# EAGLE design ! Famicom_IO_SNES_REV1.5 (EAGLE 9.1.3)
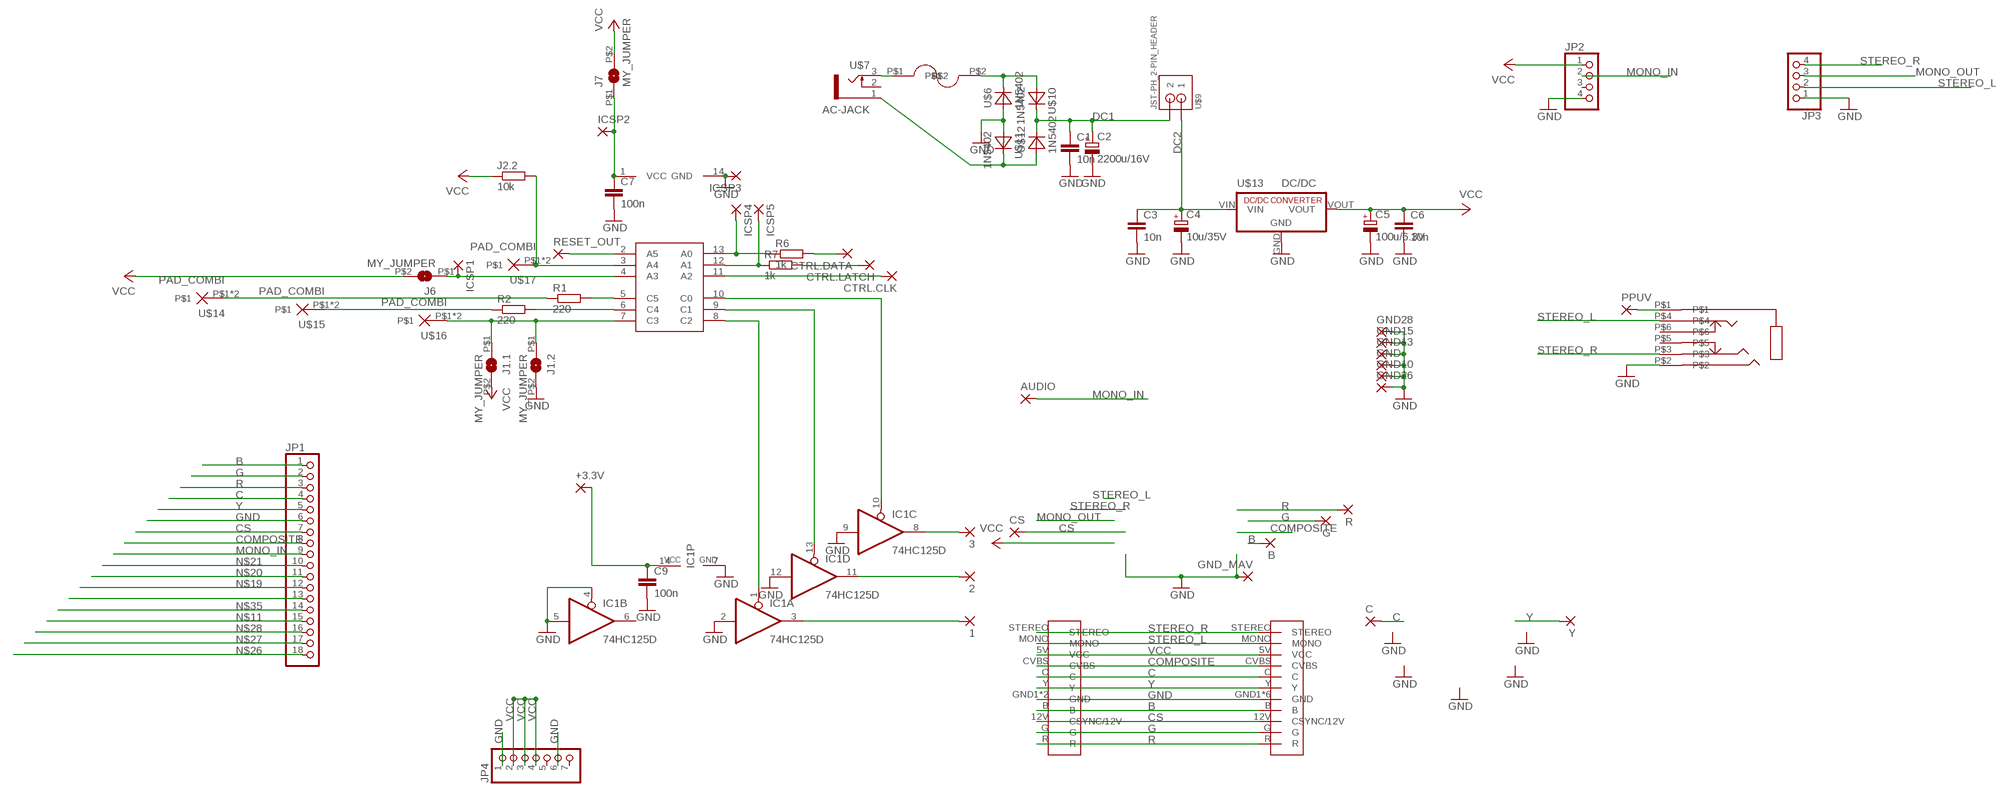
[diagram p0: schematic, sheet 1]

## Parts
1  SMD2  [SMD1,27-2,54]
2  SMD2  [SMD1,27-2,54]
3  SMD2  [SMD1,27-2,54]
+3.3V  SMD2  [SMD1,27-2,54]
AUDIO  SMD2  [SMD1,27-2,54]
B  SMD2  [SMD1,27-2,54]
C  SMD2  [SMD1,27-2,54]
C1  10n  C0805  [Z0805]
C2  2200u/16V  CPOL-EUE5-13  [E5-13]
C3  10n  C0805  [Z0805]
C4  10u/35V  CPOL-EUB  [PANASONIC_B]
C5  100u/6.3V  CPOL-EUD  [PANASONIC_D]
C6  10n  C0805  [Z0805]
C7  100n  C0805  [Z0805]
C9  100n  C0805  [Z0805]
CS  SMD2  [SMD1,27-2,54]
CTRL.CLK  SMD2  [SMD1,27-2,54]
CTRL.DATA  SMD2  [SMD1,27-2,54]
CTRL.LATCH  SMD2  [SMD1,27-2,54]
G  SMD2  [SMD1,27-2,54]
GND  SMD5  [SMD2,54-5,08]
GND10  SMD5  [SMD2,54-5,08]
GND13  SMD5  [SMD2,54-5,08]
GND15  SMD5  [SMD2,54-5,08]
GND26  SMD5  [SMD2,54-5,08]
GND28  SMD5  [SMD2,54-5,08]
GND_MAV  SMD2  [SMD1,27-2,54]
IC1  74HC125D  [SO14]
ICSP1  1,6/0,8  [1,6/0,8]
ICSP2  1,6/0,8  [1,6/0,8]
ICSP3  1,6/0,8  [1,6/0,8]
ICSP4  1,6/0,8  [1,6/0,8]
ICSP5  1,6/0,8  [1,6/0,8]
J1.1  MY_JUMPER  [MYJUMP]
J1.2  MY_JUMPER  [MYJUMP]
J2.2  10k  R0805  [Z0805]
J6  MY_JUMPER  [MYJUMP]
J7  MY_JUMPER  [MYJUMP]
JP1  PINHD-1X18_2.00  [1X18M]
JP2  PINHD-1X04_2.54-S  [1X04-S]
JP3  PINHD-1X04_2.54-S  [1X04-S]
JP4  PINHD-1X07_2.54-S  [1X07-S]
PPUV  SMD2  [SMD1,27-2,54]
R  SMD2  [SMD1,27-2,54]
R1  220  R0805  [Z0805]
R2  220  R0805  [Z0805]
R6  1k  R0805  [Z0805]
R7  1k  R0805  [Z0805]
RESET_OUT  SMD2  [SMD1,27-2,54]
U$2  FUSEHOLDER  [FUSEHOLDER]
U$5  PIC16F630_SIMPLE  [PIC16F630]
U$6  1N5402  [DO201]
U$7  AC-JACK  [AC-JACK]
U$8  PJ-342D  [PJ-342]
U$9  JST-PH_2-PIN_HEADER  [JST_B2B-PH_HEADER]
U$10  1N5402  [DO201]
U$11  1N5402  [DO201]
U$12  1N5402  [DO201]
U$13  DC/DC  [RECOM]
U$14  PAD_COMBI  [PAD_COMBI]
U$15  PAD_COMBI  [PAD_COMBI]
U$16  PAD_COMBI  [PAD_COMBI]
U$17  PAD_COMBI  [PAD_COMBI]
U$19  GC-MULTIAV  [GC-MULTIAV]
U$20  SNES-MULTIAV2  [SNES-MULTIAV2]
Y  SMD2  [SMD1,27-2,54]

## Nets
AC1A: U$2.P$1 U$7.3
AC1B: U$2.P$2 U$6.C U$10.A
AC2: U$7.1 U$11.C U$12.A
B: B.1(P) JP1.1 U$19.B U$20.B
C: C.1(P) JP1.4 U$19.C U$20.C
COMPOSITE: JP1.8 PPUV.1(P) U$8.P$1 U$19.CVBS U$20.CVBS
CS: CS.1(P) JP1.7 U$19.12V(CSYNC/12V) U$20.12V(CSYNC/12V)
DC1: C1.1 C2.+ U$9.P2 U$10.C U$12.C
DC2: C3.1 C4.+ U$9.P1 U$13.VIN
G: G.1(P) JP1.2 U$19.G U$20.G
GND: C1.2 C2.- C3.2 C4.- C5.- C6.2 C7.2 C9.2 GND10.1(P) GND13.1(P) GND15.1(P) GND26.1(P) GND28.1(P) GND.1(P) GND_MAV.1(P) IC1.2(A:I) IC1.4(B:OE) IC1.5(B:I) IC1.7(P:GND) IC1.9(C:I) IC1.12(D:I) ICSP3.1(P) J1.2.P$2 JP1.6 JP2.4 JP3.1 JP4.1 JP4.6 U$5.14(GND) U$6.A U$8.P$2 U$11.A U$13.GND U$19.GND1(GND) U$19.GND2(GND) U$19.GND3(GND) U$19.GND4(GND) U$19.GND5(GND) U$19.GND6(GND) U$20.GND1(GND) U$20.GND2(GND)
MONO_IN: AUDIO.1(P) JP1.9 JP2.2
MONO_OUT: JP3.3
N$11: 3.1(P) IC1.8(C:O) JP1.15
N$12: J2.2.2 U$5.3(A4) U$17.P$1 U$17.P$2
N$13: R1.2 U$5.5(C5)
N$14: R2.2 U$5.6(C4)
N$15: R1.1 U$14.P$1 U$14.P$2
N$16: R2.1 U$15.P$1 U$15.P$2
N$17: J1.1.P$1 J1.2.P$1 U$5.7(C3) U$16.P$1 U$16.P$2
N$19: CTRL.DATA.1(P) JP1.12 R6.2
N$20: CTRL.LATCH.1(P) JP1.11 R7.2
N$21: CTRL.CLK.1(P) JP1.10 U$5.11(A2)
N$23: IC1.10(C:OE) U$5.10(C0)
N$24: IC1.13(D:OE) U$5.9(C1)
N$25: IC1.1(A:OE) U$5.8(C2)
N$26: +3.3V.1(P) C9.1 IC1.14(P:VCC) JP1.18
N$27: 1.1(P) IC1.3(A:O) JP1.17
N$28: 2.1(P) IC1.11(D:O) JP1.16
N$29: JP1.13
N$31: C7.1 ICSP2.1(P) J7.P$1 U$5.1(VCC)
N$32: ICSP1.1(P) J6.P$1 U$5.4(A3)
N$33: ICSP4.1(P) R6.1 U$5.13(A0)
N$34: ICSP5.1(P) R7.1 U$5.12(A1)
N$35: JP1.14 RESET_OUT.1(P) U$5.2(A5)
R: JP1.3 R.1(P) U$19.R U$20.R
STEREO_L: JP3.2 U$8.P$4 U$19.MONO U$20.MONO
STEREO_R: JP3.4 U$8.P$3 U$19.STEREO U$20.STEREO
VCC: C5.+ C6.1 J1.1.P$2 J2.2.1 J6.P$2 J7.P$2 JP2.1 JP4.2 JP4.3 JP4.4 U$13.VOUT U$19.5V(VCC) U$20.5V(VCC)
Y: JP1.5 U$19.Y U$20.Y Y.1(P)
Unconnected: IC1.6(B:O) JP2.3 JP4.5 JP4.7 U$7.2 U$8.P$5 U$8.P$6

## Library data of the parts
1-3 +3.3V AUDIO B C CS CTRL.CLK CTRL.DATA CTRL.LATCH G GND_MAV PPUV R RESET_OUT Y = wirepad:SMD2: SMD PAD
C1 C3 C6 C7 C9 = snes_div:C0805
C2 = resistor:CPOL-EU: POLARIZED CAPACITOR, European symbol
C4 C5 = rcl:CPOL-EU: POLARIZED CAPACITOR, European symbol
GND GND10 GND13 GND15 GND26 GND28 = wirepad:SMD5: SMD PAD
IC1 = 74xx-eu:74*125: Quad bus BUFFER, 3-state
ICSP1-ICSP5 = wirepad:1,6/0,8: THROUGH-HOLE PAD
J1.1 J1.2 J6 J7 = snes_div:MY_JUMPER
J2.2 R1 R2 R6 R7 = snes_div:R0805
JP1 = pinhead-2:PINHD-1X18: PIN HEADER
JP2 JP3 = pinhead-2:PINHD-1X04: PIN HEADER
JP4 = pinhead-2:PINHD-1X07: PIN HEADER
U$2 = nintendo:FUSEHOLDER
U$5 = snes_div:PIC16F630_SIMPLE
U$6 U$10-U$12 = nintendo:1N5402
U$7 = nintendo:AC-JACK
U$8 = TRP_Custom:PJ-342D
U$9 = SRG:JST-PH_2-PIN_HEADER: 2-pin JST PH Shrouded Header, top entry P/N B2B-PH-K-S Mating connector PHR-2 Mating cable assembly: Sparkfun PRT-09914 <http://www.sparkfun.com/products/9914>
U$13 = nintendo:DC/DC
U$14-U$17 = MS_Mod:PAD_COMBI
U$19 = nintendo:GC-MULTIAV
U$20 = nintendo:SNES-MULTIAV2

## Board
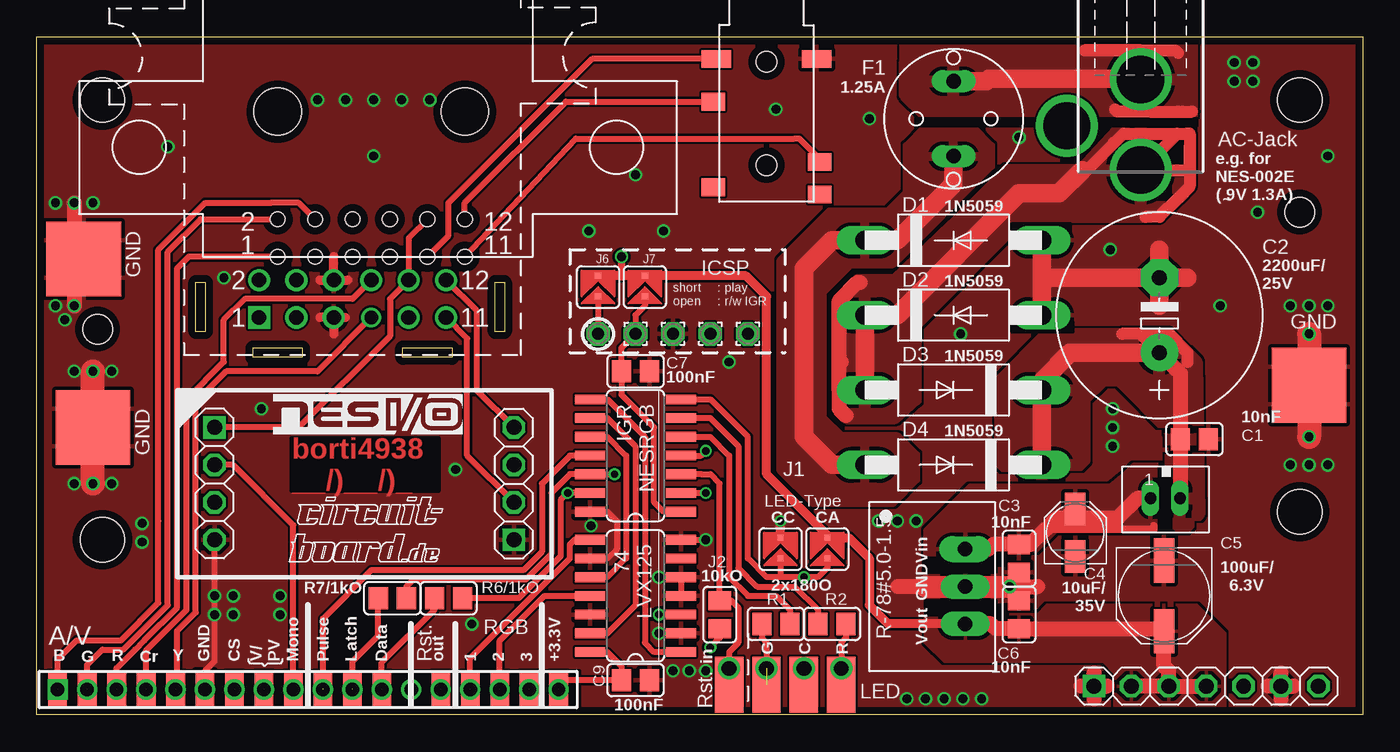
[diagram p1: board, top side]
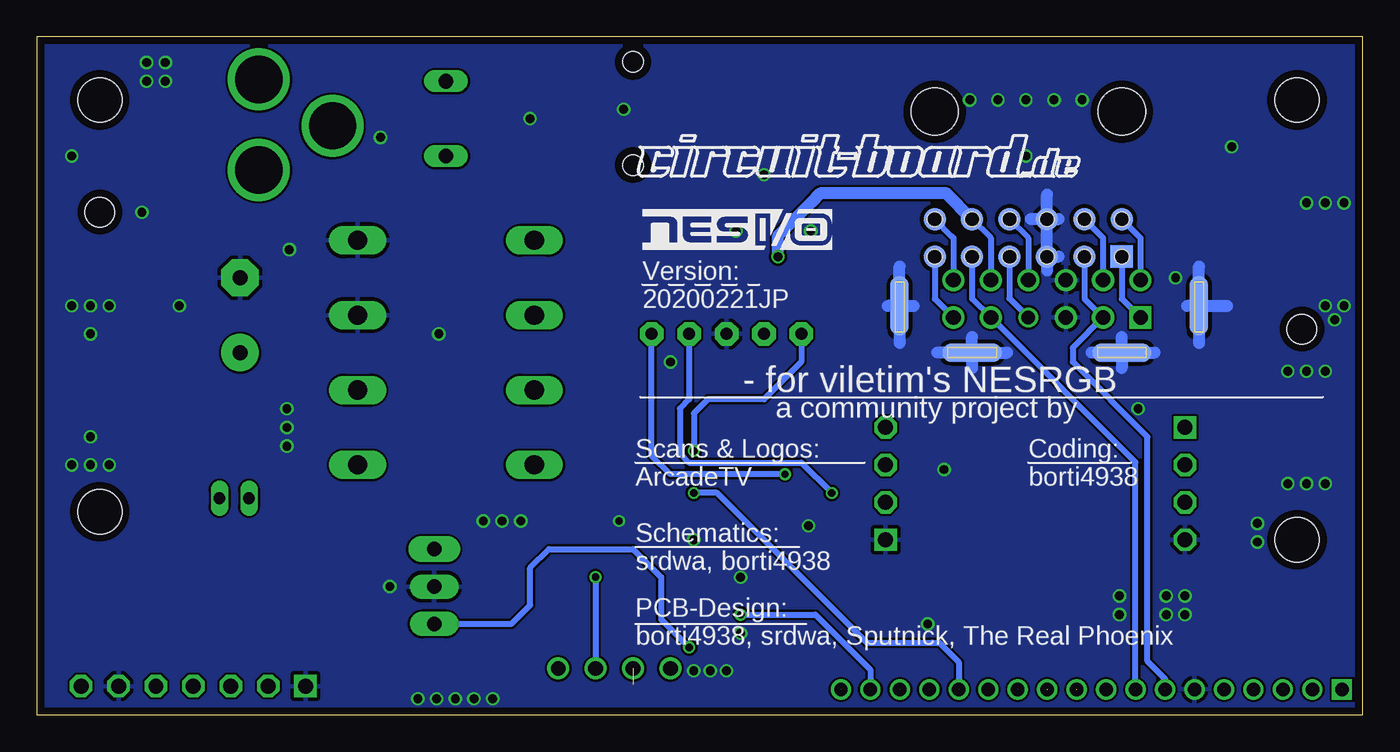
[diagram p2: board, bottom side, seen from below]

Size 90 x 46 mm. Coordinates in mm from the lower left corner, seen from the top.
Outline: 0,46 90,46 90,0 0,0 0,46
Copper layers (1*16): Top 0.035mm / dielectric 1.6mm / Bottom 0.035mm
Design rules "Elecrow_2-layer_PCB_eagle_rule": minimum track width 6mil, minimum drill 12mil, track to track 6mil, track to pad 6mil, pad to pad 6mil, via to via 8mil, smd to smd 0mil, copper to edge 20mil, drill to drill 10mil, minimum pad ring 6mil, minimum via ring 6mil, stop-mask expansion 0mil, vias tented up to drill 100mil, thermal gap 10mil
Holes 3 mm at 4.45,41.72 4.45,11.88 85.72,41.72 85.72,13.78
Holes 2 mm at 4.13,26.16 85.72,34.1
tRestrict: area 3,10.4 to 6,13.4; area 3,40.2 to 6,43.2; area 59.7,40 to 67.9,40.5; area 60.3,6.8 to 65.1,7.7; area 0,0 to 36.8,3; area 72.4,40 to 78.7,40.5; area 76.2,12.4 to 77,16.8; area 65.1,6.5 to 65.9,7.4; area 84.2,40.2 to 87.2,43.2; area 84.2,12.3 to 87.2,15.3; area 66.2,32.7 to 70.2,33.3; area 66.2,26 to 70.3,26.6; 2 more areas
bRestrict: area 3,10.4 to 6,13.4; area 3,40.2 to 6,43.2; area 84.2,40.2 to 87.2,43.2; area 84.2,12.3 to 87.2,15.3

### Footprints (pad centres in the part's own frame; a part is rotated, then mirrored left to right if it is on the bottom)
SMD1,27-2,54 = smd 1.27 x 2.54: 1 0,0
Z0805 = smd 1.3 x 1.5: 1 -0.95,0; 2 0.95,0
E5-13 = drill 1.016 pad 2.54: + -2.54,0 | drill 1.016 pad 2.54 octagon: - 2.54,0
PANASONIC_B = smd 2.2 x 1.4: + 1.6,0; - -1.6,0
PANASONIC_D = smd 3 x 1.4: + 2.4,0; - -2.4,0
SMD2,54-5,08 = smd 2.54 x 5.08: 1 0,0
SO14 = smd 0.66 x 2.032: 1 -3.81,-3.073; 2 -2.54,-3.073; 3 -1.27,-3.073; 4 0,-3.073; 5 1.27,-3.073; 6 2.54,-3.073; 7 3.81,-3.073; 8 3.81,3.073; 9 2.54,3.073; 10 1.27,3.073; 11 0,3.073; 12 -1.27,3.073; 13 -2.54,3.073; 14 -3.81,3.073
1,6/0,8 = drill 0.813 pad 1.6 octagon: 1 0,0
MYJUMP = smd 0.406 x 0.406: P$1 -0.635,0; P$2 0.765,0
1X18M = drill 0.914 square: 1 -17,0 | drill 0.914: 2 -15,0; 3 -13,0; 4 -11,0; 5 -9,0; 6 -7,0; 7 -5,0; 8 -3,0; 9 -1,0; 10 1,0; 11 3,0; 12 5,0; 13 7,0; 14 9,0; 15 11,0; 16 13,0; 17 15,0; 18 17,0
1X04-S = drill 1.016 square: 1 -3.81,0 | drill 1.016 octagon: 2 -1.27,0; 3 1.27,0; 4 3.81,0
1X07-S = drill 1.016 square: 1 -7.62,0 | drill 1.016 octagon: 2 -5.08,0; 3 -2.54,0; 4 0,0; 5 2.54,0; 6 5.08,0; 7 7.62,0
FUSEHOLDER = drill 1 pad 1.422 long: P$1 -2.54,0; P$2 2.54,0
PIC16F630 = smd 0.66 x 2.032: 1 -3.81,-3.073; 2 -2.54,-3.073; 3 -1.27,-3.073; 4 0,-3.073; 5 1.27,-3.073; 6 2.54,-3.073; 7 3.81,-3.073; 8 3.81,3.073; 9 2.54,3.073; 10 1.27,3.073; 11 0,3.073; 12 -1.27,3.073; 13 -2.54,3.073; 14 -3.81,3.073
DO201 = drill 1.3 long: A 6,0; C -6,0
AC-JACK = drill 3.2 pad 4: 1 0,8.57; 2 5,5.57; 3 0,2.42
PJ-342 = smd 1.2 x 2: P$1 2.3,-3.4; P$2 2.3,3.4 | smd 1.2 x 1.6: P$3 5.2,-3.6; P$4 9.3,3.6; P$5 11,-3.6; P$6 11.5,3.6 | hole 1.4: 2.5,0; 9.5,0
JST_B2B-PH_HEADER = drill 0.8 long: P1 1.075,0.048; P2 -0.925,0.048
RECOM = drill 1 pad 1.676 long: GND 0,0; VOUT 2.54,0 | drill 1 pad 1.778 long: VIN -2.54,0
PAD_COMBI = smd 1.93 x 3.81: P$1 0,0 | drill 1: P$2 0,1.111
GC-MULTIAV = drill 1: 5V 15.24,5.08; 12V 7.62,2.54; B 7.62,5.08; C 12.7,5.08; CVBS 15.24,2.54; G 5.08,5.08; GND1 10.16,2.54; GND2 10.16,5.08; MONO 17.78,2.54; STEREO 17.78,5.08 | smd 1.27 x 4.064 bottom: GND3 1.111,3.334; GND6 21.431,3.334 | smd 4.064 x 1.27 bottom: GND4 6.35,0.159; GND5 16.51,0.159 | drill 1 square: R 5.08,2.54 | drill 0.9: Y 12.7,2.54
SNES-MULTIAV2 = smd 1.524 x 1.524 bottom: 5V 15.24,2.54; 12V 7.62,0; B 7.62,2.54; C 12.7,2.54; CVBS 15.24,0; G 5.08,2.54; GND1 10.16,0; GND2 10.16,2.54; MONO 17.78,0; R 5.08,0; STEREO 17.78,2.54; Y 12.7,0 | hole 3.2: 5.08,9.842; 17.78,9.842 | hole 1: 5.08,0; 5.08,2.54; 7.62,2.54; 10.16,2.54; 12.7,2.54; 12.7,0; 10.16,0; 7.62,0; 15.24,2.54; 17.78,2.54; 17.78,0; 15.24,0

### Placement (x,y rotation side)
1  33.42,1.71 0 top
2  31.42,1.71 0 top
3  29.42,1.71 0 top
+3.3V  35.42,1.71 180 top
AUDIO  17.41,1.71 180 top
B  1.41,1.71 180 top
C  7.42,1.71 180 top
C1  78.58,18.7 0 top
C2  76.2,27.11 90 top
C3  66.67,10.61 270 top
C4  70.48,12.35 90 top
C5  76.52,8.06 270 top
C6  66.67,6.79 90 top
C7  40.64,23.3 0 top
C9  40.64,2.35 0 top
CS  13.42,1.71 180 top
CTRL.CLK  19.42,1.71 0 top
CTRL.DATA  23.42,1.71 0 top
CTRL.LATCH  21.42,1.71 0 top
G  3.42,1.71 180 top
GND  3.81,20.77 90 top
GND10  86.36,23.62 270 top
GND13  86.36,21.08 90 top
GND15  3.17,29.66 90 top
GND26  3.17,32.2 90 top
GND28  3.81,18.23 90 top
GND_MAV  11.42,1.71 0 top
IC1  40.64,8.06 90 top
ICSP1  38.1,25.84 0 top
ICSP2  40.64,25.84 0 top
ICSP3  43.18,25.84 0 top
ICSP4  45.72,25.84 0 top
ICSP5  48.26,25.84 0 top
J1.1  53.66,11.24 90 top
J1.2  50.48,11.24 90 top
J2.2  46.35,6.79 90 top
J6  38.1,29.02 90 top
J7  41.27,29.02 90 top
JP1  18.41,1.71 0 top
JP2  12.06,15.68 270 top
JP3  32.38,15.68 90 top
JP4  79.38,1.94 0 top
PPUV  15.42,1.71 180 top
R  5.42,1.71 180 top
R1  50.16,6.16 0 top
R2  53.98,6.16 180 top
R6  27.94,7.91 180 top
R7  24.13,7.91 180 top
RESET_OUT  27.42,1.71 180 top
U$2  62.23,40.45 270 top
U$3  [NESIO-LOGO]  16.03,19.02 0 top
U$4  [NESIO-LOGO]  48.9,31.56 0 bottom
U$5  40.64,17.59 90 top
U$6  62.23,32.2 0 top
U$7  74.93,45.53 180 top
U$8  49.53,46.8 270 top
U$9  76.68,14.73 180 top
U$10  62.23,16.95 180 top
U$11  62.23,27.11 0 top
U$12  62.23,22.04 180 top
U$13  63.02,8.7 270 top
U$14  49.53,2.03 0 top
U$15  54.61,2.03 0 top
U$16  52.07,2.03 0 top
U$17  46.99,2.03 0 top
U$19  10,24.42 0 top
U$20  11.27,31.08 0 top
Y  9.42,1.71 180 top

### Tracks (layer width: path | path; a pad name or v marks a point on that pad's centre or on a via)
AC1A
  Top 0.813: 74.93,40.93 74.95,43.13 U$7.3 74.93,45.09 71.12,45.09 77.28,45.09 77.47,44.9 | 74.93,40.93 75.56,40.93 77.47,40.93 77.79,40.93 78.42,40.93 | 73.18,41.09 73.34,40.93 74.93,40.93
  Top 1.27: U$7.3 74.93,43.15 64.61,43.15 64.45,42.99 U$2.P$1
  pour Top: 78.42,40.45 78.42,46.16 58.93,46.16 58.9,42.51 58.9,42.07 60.2,40.77 67.79,40.77 69.53,42.51 70.51,42.49 72.55,40.45
AC1B
  Top 1.27: U$2.P$2 62.23,36.01 58.42,32.2 U$6.C 53.98,32.2 52.07,30.29 52.07,18.86 53.98,16.95 U$10.A
  pour Top: 62.23,39.81 60.33,39.81 59.05,38.55 59.05,37.91 59.05,35.37 57.78,34.1 53.82,34.1 50.48,30.77 50.48,16.64 52.7,14.41 55.88,14.41 58.1,14.41 59.69,16 59.69,17.59 58.42,18.86 55.24,18.86 54.61,18.86 53.34,20.13 53.34,28.7 55.24,30.61 58.1,30.61 64.77,37.27 64.77,38.55 63.5,39.81
AC2
  Top 0.813: U$7.1 74.93,39.33 | 71.28,36.96 73.1,38.78 73.76,39.44 77.41,39.44 | 78.26,38.55 78.26,36.96 | 78.26,36.96 78.26,35.85 77.47,35.05 | 75.25,33.78 76.2,33.78 77.47,35.05 | U$7.1 78.26,36.96 | 77.47,35.05 | 78.26,37.43 78.26,38.55 | 78.26,38.55 78.26,39.44 78.05,39.44 77.41,39.44 | U$7.1 77.41,39.44
  Top 1.016: 54.45,27.75 54.45,22.04 U$12.A 54.61,22.04 54.45,21.88 54.45,20.77 54.93,20.29 | 54.45,27.75 54.45,28.07 | 54.45,28.07 54.45,27.75 | 54.45,27.75 54.45,23.94 54.61,23.94 | 54.45,28.07 55.72,29.34 55.88,29.34
  Top 1.27: 70.96,36.96 69.37,35.37 66.67,35.37 58.42,27.11 U$11.C U$12.A
  pour Top: 75.56,39.66 73.34,39.66 70.85,36.96 65.88,36.96 62.07,33.15 58.26,29.5 55.72,29.5 54.45,28.23 54.45,20.61 54.93,20.13 58.26,20.13 59.69,21.4 59.69,23.78 59.69,26.48 66.99,33.78 75.56,33.78 76.36,34.58 77.47,35.69 77.47,37.75
B  (via drill 0.35)  (1 unrouted)
  Top 0.406: JP1.1 1.41,3.76 2.7,5.05 5.71,5.05 8.26,7.59 8.26,13.14 8.26,31.56 11.43,34.73 15.88,34.73 17.78,34.73 U$20.B
  Bottom 0.406: U$20.B 17.62,32.35 U$19.B
  other vias: 18.89,33.62
C  (via drill 0.35)  (1 unrouted)
  Top 0.406: C.1 7.42,4.37 10.16,7.11 10.16,21.4 12.7,23.94 12.7,26.8 14.13,28.23 21.43,28.23 U$19.C
  Bottom 0.406: U$20.C 22.7,32.35 U$19.C
  other vias: 23.97,33.62
COMPOSITE  (via drill 0.35)  (1 unrouted)
  Top 0.406: U$8.P$1 37.7,44.5 27.94,34.73 27.94,32.51 U$20.CVBS
  Bottom 0.406: U$20.CVBS 26.51,28.23 U$19.CVBS 15.41,17.13 JP1.8
  other vias: 26.51,31.08
CS  (via drill 0.35)  (1 unrouted)
  Bottom 0.406: JP1.7 13.41,2.43 14.61,3.62 14.61,18.86 19.68,23.94 19.68,24.89 U$19.12V 18.89,28.23 U$20.12V
  other vias: 18.89,31.08
DC1
  Top 0.305: U$9.P2 77.55,14.73
  Top 0.813: C2.+ 74.93,25.84 | 78.11,23.94 78.11,24.57 76.83,25.84 76.2,25.84 74.93,25.84 | 74.93,25.84 73.66,25.84
  Top 1.016: C2.+ 77.31,23.46 77.63,23.14 C1.1 77.63,17.59 77.63,16.16 77.63,14.71 U$9.P2
  Top 1.27: U$10.C U$12.C 68.26,22.07 68.26,22.67 70.14,24.57 C2.+ 76.2,24.89
  pour Top: 65.41,17.11 65.41,22.04 65.41,22.67 68.58,25.84 76.83,25.84 78.74,23.94 78.9,13.62 77.95,12.67 77.63,12.67 76.99,13.3 76.99,19.18 73.5,22.67 72.39,22.67 71.12,21.4 71.12,17.27 70.17,16.32 66.2,16.32
DC2
  Top 0.508: 68.49,12.6 75.82,12.6 75.82,12.83
  Top 1.016: 69.85,13.32 69.22,13.32 68.49,12.6 67.45,11.55 C3.1 64.93,11.55 64.61,11.24 U$13.VIN | C4.+ 69.85,13.32 | U$9.P1 74.72,14.68 73.36,13.32 69.85,13.32
  pour Top: 62.87,9.97 60.96,9.97 60.33,10.61 60.33,12.51 63.34,15.53 72.87,15.53 73.82,16.32 74.45,16.95 76.2,16.95 76.68,16.48 76.68,12.99 76.2,12.51 69.22,12.51 67.31,10.61 64.14,10.61 63.5,9.97
G  (via drill 0.35)  (1 unrouted)
  Top 0.406: U$20.G 11.11,33.62 8.89,31.41 8.89,7.43 5.87,4.41 4.45,4.41 3.42,3.39 G.1
  Bottom 0.406: U$20.G 15.08,32.35 U$19.G
  other vias: 16.35,33.62
GND  (via drill 0.35, 0.5, 0.6)
  Top 0.406: IC1.4 IC1.5 v42.23,9.34 | IC1.7 v45.4,11.88 | IC1.2 v42.23,5.53 | GND_MAV.1 11.43,2.36 11.43,2.99 12.06,3.62 JP2.4 | IC1.9 38.73,10.61 39.37,11.24 39.37,13.14 38.73,13.78 U$5.14
  Top 0.61: J1.2.P$2 v50.48,13.14 | 66.82,8.85 66.67,8.7 | 20.16,31.08 U$19.GND2 19.21,29.5 21.11,29.5 | U$19.GND1 19.21,26.96 | U$19.GND1 20.95,26.96 | U$19.GND1 20.16,25.85
  Top 1.016: U$13.GND 64.77,8.7 v66.04,8.7 66.67,8.7 | 66.67,8.7 C3.2 | U$13.GND 66.67,8.7 | 66.67,8.7 67.94,8.7 | U$13.GND 60.33,8.7 | 60.33,8.7 58.42,8.7 | v2.54,34.73 v2.54,27.75 | JP4.1 71.75,2.83 | JP4.1 70.89,1.94 | JP4.1 72.64,1.94 | JP4.1 71.75,1.08 | JP4.6 84.45,2.83 | JP4.6 83.59,1.94 | JP4.6 85.32,1.94 | JP4.6 84.45,1.08 | 60.33,8.7
  Top 1.27: U$6.A 68.23,29.66 | 68.23,29.66 U$11.A | C2.- 68.23,29.66 | C2.- 78.11,29.66 | C2.- 76.2,31.56 | C2.- 76.2,27.75
  Top 1.5: 60.33,8.7 66.67,8.7
  Top 1.626: v3.81,15.68 v3.81,23.3 | v86.36,25.84 v86.36,18.86
  Bottom 0.813: U$20.GND1 U$20.GND2 | U$20.GND1 20.64,31.08 | U$20.GND2 22.54,33.62 | U$20.GND2 20.64,33.62 | U$20.GND1 | U$19.GND3 11.91,27.75 | U$19.GND3 9.21,27.75 | U$19.GND4 14.13,24.57 | U$19.GND4 18.41,24.57 | U$19.GND5 24.13,24.57 | U$19.GND5 28.89,24.57 | U$19.GND6 32.23,27.75 | U$19.GND6 30.48,27.75 | U$19.GND3 11.11,30.42 | U$19.GND3 11.11,25.24 | U$19.GND4 16.35,25.62 | U$19.GND4 16.35,23.53 | U$19.GND5 26.51,25.62 | U$19.GND5 26.51,23.53 | U$19.GND6 31.43,25.24 | U$19.GND6 31.43,30.42 | U$20.GND1 21.43,30.13 | U$20.GND2 21.43,35.3
  other vias: 13.34,8.06 22.86,37.91 15.24,20.77 50.16,41.09 7.14,12.99 1.27,34.73 29.53,6.16 66.67,39.18 8.89,38.55 19.05,41.72 1.91,26.8 86.36,27.75 85.09,27.75 87.63,16.95 86.36,16.95 85.09,16.95 87.63,27.75 73.03,19.5 73.03,18.23 44.29,2.99 24.77,41.72 72.87,31.56 80.33,27.75 5.08,15.68 61.59,1.08 12.06,6.79 16.51,6.79 60.33,1.08 64.14,1.08 45.4,2.99 62.71,25.84 82.87,34.1 37.62,12.83 2.54,15.68 87.63,37.91 12.7,29.66 26.67,41.72 5.08,23.3 56.52,40.45 16.51,8.06 2.54,23.3 62.87,1.08 82.55,44.26 82.55,42.99 81.28,44.26 42.55,32.83 12.06,8.06 43.18,2.99 81.28,42.99 59.05,1.08 57.15,13.14 73.03,20.77 13.34,6.79 58.42,13.14 3.81,34.73 20.95,41.72 22.86,41.72 37.47,32.83 40.64,36.64 1.27,27.75 28.42,16.64 46.99,23.94 7.14,11.72 59.69,13.14 21.43,31.08 21.43,33.62
  pour Top (rank 6): -0.64,-1.46 90.8,-1.46 90.8,46.8 -0.64,46.8
  pour Bottom (rank 6): -1.91,-6.54 90.97,-6.54 90.81,48.7 86.36,48.7 -1.91,48.86
MONO_IN
  Top 0.406: JP2.2 13.34,16.95 17.41,12.88 JP1.9
N$11  (1 unrouted)
  Top 0.406: IC1.8 36.51,11.88 36.2,11.56 36.2,10.61 29.42,3.83 3.1
N$12
  Top 0.305: U$17.P$1 U$17.P$2
  Top 0.406: U$5.3 45.09,16.32 45.72,16.32 46.35,15.68 J2.2.2 47.15,7.74 47.62,7.27 47.62,4.89 46.99,4.26 46.99,2.35 U$17.P$2
N$13
  Top 0.406: U$5.5 45.72,18.86 46.99,17.59 46.99,9.65 46.99,9.34 48.26,8.06 50.16,8.06 51.12,7.11 51.12,5.68 R1.2
N$14
  Top 0.406: U$5.6 45.72,20.13 47.62,18.23 47.62,9.97 48.9,8.7 51.44,8.7 53.02,7.11 53.02,6.79 R2.2
N$15  (1 unrouted)
  Top 0.406: R1.1 49.21,5.68 49.21,5.21 49.53,4.89 U$14.P$2
N$16
  Top 0.305: U$15.P$1 54.61,2.99 U$15.P$2
  Top 0.406: R2.1 54.92,5.21 54.61,4.89 54.61,2.99
N$17  (via drill 0.5)
  Top 0.305: U$16.P$1 U$16.P$2
  Top 0.406: 50.48,9.34 v52.07,9.34 53.02,9.34 53.66,9.97 J1.1.P$1 | 50.48,9.34 50.32,9.34 49.53,9.34 48.26,10.61 48.26,18.86 45.72,21.4 U$5.7 | J1.2.P$1 50.48,9.34
  Bottom 0.406: v52.07,9.34 U$16.P$2
N$19  (1 unrouted)
  Top 0.406: CTRL.DATA.1 23.42,3.54 26.99,7.11 R6.2
N$20  (1 unrouted)
  Top 0.406: CTRL.LATCH.1 21.42,3.63 23.18,5.37 R7.2
N$21  (1 unrouted)
  Top 0.406: U$5.11 36.2,17.59 34.29,15.68 34.29,11.07 33.03,9.81 22.7,9.81 19.42,6.53 CTRL.CLK.1
N$23
  Top 0.406: U$5.10 38.73,18.86 40.01,17.59 40.01,10.61 38.73,9.34 IC1.10
N$24
  Top 0.406: U$5.9 38.73,20.13 40.64,18.23 40.64,7.43 38.73,5.53 IC1.13
N$25
  Top 0.406: IC1.1 43.18,4.26 41.91,4.26 41.27,4.89 41.27,7.43 41.27,18.86 38.73,21.4 U$5.8
N$26  (1 unrouted)
  Top 0.406: IC1.14 37.78,4.26 38.74,4.25 39.69,3.3 C9.1 35.56,2.35 35.41,2.21 JP1.18
N$27  (via drill 0.5)  (1 unrouted)
  Top 0.406: IC1.3 v42.23,6.79
  Bottom 0.406: v42.23,6.79 37.15,6.79 33.41,3.06 JP1.17
N$28  (1 unrouted)
  Top 0.406: IC1.11 34.45,8.06 31.42,5.04 2.1
N$31
  Top 0.406: J7.P$1 41.27,27.75 40.64,27.11 ICSP2.1 39.69,24.89 C7.1 39.69,21.71 41.27,20.13 41.91,19.49 41.91,14.41 42.55,13.78 U$5.1
N$32  (via drill 0.5)
  Top 0.406: J6.P$1 38.1,26.48 ICSP1.1 | U$5.4 45.09,17.59 v45.4,17.91
  Bottom 0.406: ICSP1.1 38.1,23.94 40.64,21.4 44.45,21.4 45.4,20.45 v45.4,17.91
N$33  (via drill 0.5)
  Top 0.406: U$5.13 v36.04,15.05 35.56,14.57 35.56,10.76 33.18,8.38 32.7,7.91 R6.1
  Bottom 0.406: ICSP4.1 45.72,21.4 46.35,20.77 46.35,17.75 45.72,17.11 38.1,17.11 v36.04,15.05
N$34  (via drill 0.5)
  Top 0.406: v39.21,16.32 U$5.12 36.2,16.32 34.92,15.05 34.92,10.92 33.18,9.18 25.56,9.18 25.08,8.7 R7.1
  Bottom 0.406: v39.21,16.32 46.99,16.32 48.26,17.59 ICSP5.1
N$35  (via drill 0.5)  (1 unrouted)
  Top 0.406: U$5.2 43.66,15.05 44.61,15.05 v45.4,15.05
  Bottom 0.406: v45.4,15.05 45.09,15.05 43.81,15.05 33.66,4.89 29.21,4.89 28.73,4.89 27.41,3.57 JP1.14
R  (via drill 0.35)  (1 unrouted)
  Top 0.406: U$20.R 10.32,31.08 9.53,30.29 9.53,7.27 7.3,5.05 6.67,4.41 5.42,3.17 R.1
  Bottom 0.406: U$20.R 16.35,28.23 U$19.R
  other vias: 16.35,31.08
STEREO_L  (via drill 0.35)
  Top 0.406: JP3.2 29.21,17.59 29.21,25.53 U$19.MONO | U$8.P$4 53.35,37.5 51.76,39.09 51.44,39.09 36.58,39.09 U$20.MONO
  Bottom 0.406: U$20.MONO 29.05,28.23 U$19.MONO
  other vias: 29.05,31.08
STEREO_R  (via drill 0.35)
  Top 0.406: U$8.P$3 35.92,41.6 29.05,34.73 U$20.STEREO | JP3.4 29.84,22.04 29.84,27.43 U$19.STEREO
  Bottom 0.406: U$20.STEREO 27.88,32.45 27.78,32.35 27.78,31.95 U$19.STEREO
  other vias: 29.05,33.62
VCC  (via drill 0.35, 0.5, 0.6)
  Top 0.406: JP2.1 17.78,19.5 23.97,25.69 23.97,28.23 U$19.5V 25.24,32.35 U$20.5V | J2.2.1 46.35,5.21 v45.72,4.57
  Top 0.508: v39.69,31.08 39.69,29.78
  Top 0.61: J6.P$2 39.69,29.78 J7.P$2 48.13,29.78 49.53,28.38 49.53,16.32 53.66,12.19 J1.1.P$2 55.12,12 56.52,10.61 56.52,7.43 57.78,6.16 U$13.VOUT
  Top 1.016: U$13.VOUT 64.77,6.16 65.08,5.85 C6.1 76.34,5.85 C5.+ 76.52,3.3 76.83,2.99 JP4.3 | JP4.3 JP4.2 | JP4.3 JP4.4
  Bottom 0.406: U$20.5V 25.24,32.35 U$19.5V | U$13.VOUT 57.78,6.16 56.52,7.43 56.52,9.97 55.24,11.24 49.53,11.24 47.62,9.34 47.62,6.48 v45.72,4.57
  Bottom 0.813: v39.69,31.08 39.69,32.51 37.47,34.73 36.83,35.37 28.26,35.37 U$20.5V
  other vias: 26.51,33.62
  pour Top: 60.96,7.43 64.14,7.43 64.77,7.43 65.41,6.79 67.94,6.79 68.58,7.43 77.47,7.43 78.74,7.43 80.01,6.16 80.64,5.53 80.64,2.35 80.64,-0.03 73.18,-0.03 73.18,2.83 72.39,3.62 61.59,3.62 60.33,4.89 60.33,6.79
Y  (via drill 0.35)  (1 unrouted)
  Top 0.406: U$19.Y 19.05,23.3 12.86,23.3 10.79,21.24 10.79,6.95 9.53,5.68 9.53,1.82 Y.1
  Bottom 0.406: U$20.Y 23.97,28.33 23.97,28.25 23.99,28.25 U$19.Y
  other vias: 23.97,31.08

### Text on the board
Top: borti4938 / __/)__/)_
tNames: F1 | 1.25A | AC-Jack | e.g. for / NES-002E / ( 9V 1.3A) | ~ | D1 | 1N5059 | GND | J6 | J7 | C2 | ICSP | D2 | 1N5059 | 2200uF/ / 25V | short / open | : play / : r/w IGR | GND | D3 | 1N5059 | 100nF | C7 | GND | IGR / NESRGB | 10nF | D4 | 1N5059 | C1 | J1 | LED-Type | C3 | CC | CA | R-78#5.0-1.5 | 10nF | 74 / LVX125 | C5 | J2 | Vin | C4 | R7/1kO | 10kO | 10uF/ / 35V | R6/1kO | 2x180O | GND | 100uF/ / 6.3V | R1 | R2 | A/V | RGB | Vout | C6 | B | G | R | Cr | Y | GND | CS | V/ / PV | Mono | Pulse | Latch | Data | Rst. | out | 1 | 2 | 3 | +3.3V | G | C | R | in | 10nF | C9 | 100nF | LED | Rst.
bNames: Version: / 20200221JP | - for viletim's NESRGB | a community project by | Coding: / borti4938 | Scans & Logos: / ArcadeTV | Schematics: / srdwa, borti4938 | PCB-Design: / borti4938, srdwa, Sputnick, The Real Phoenix
tStop: b | o | r | t | i | 4 | 9 | 3 | 8 | _ | _ | / | ) | _ | _ | / | ) | _